# Altium schematic sheet Chaos.SchDoc: Chaos
size Tabloid; Author: Taiping Li; Organization: Midnight Sun Solar Rayce Car Team; Address1: University of Waterloo; Address2: 200 University Ave W; Address3: Waterloo, ON, Canada; Address4: N2L 3E9; Revision: 1.0; SheetNumber: 3; SheetTotal: 3; Website: www.uwmidsun.com
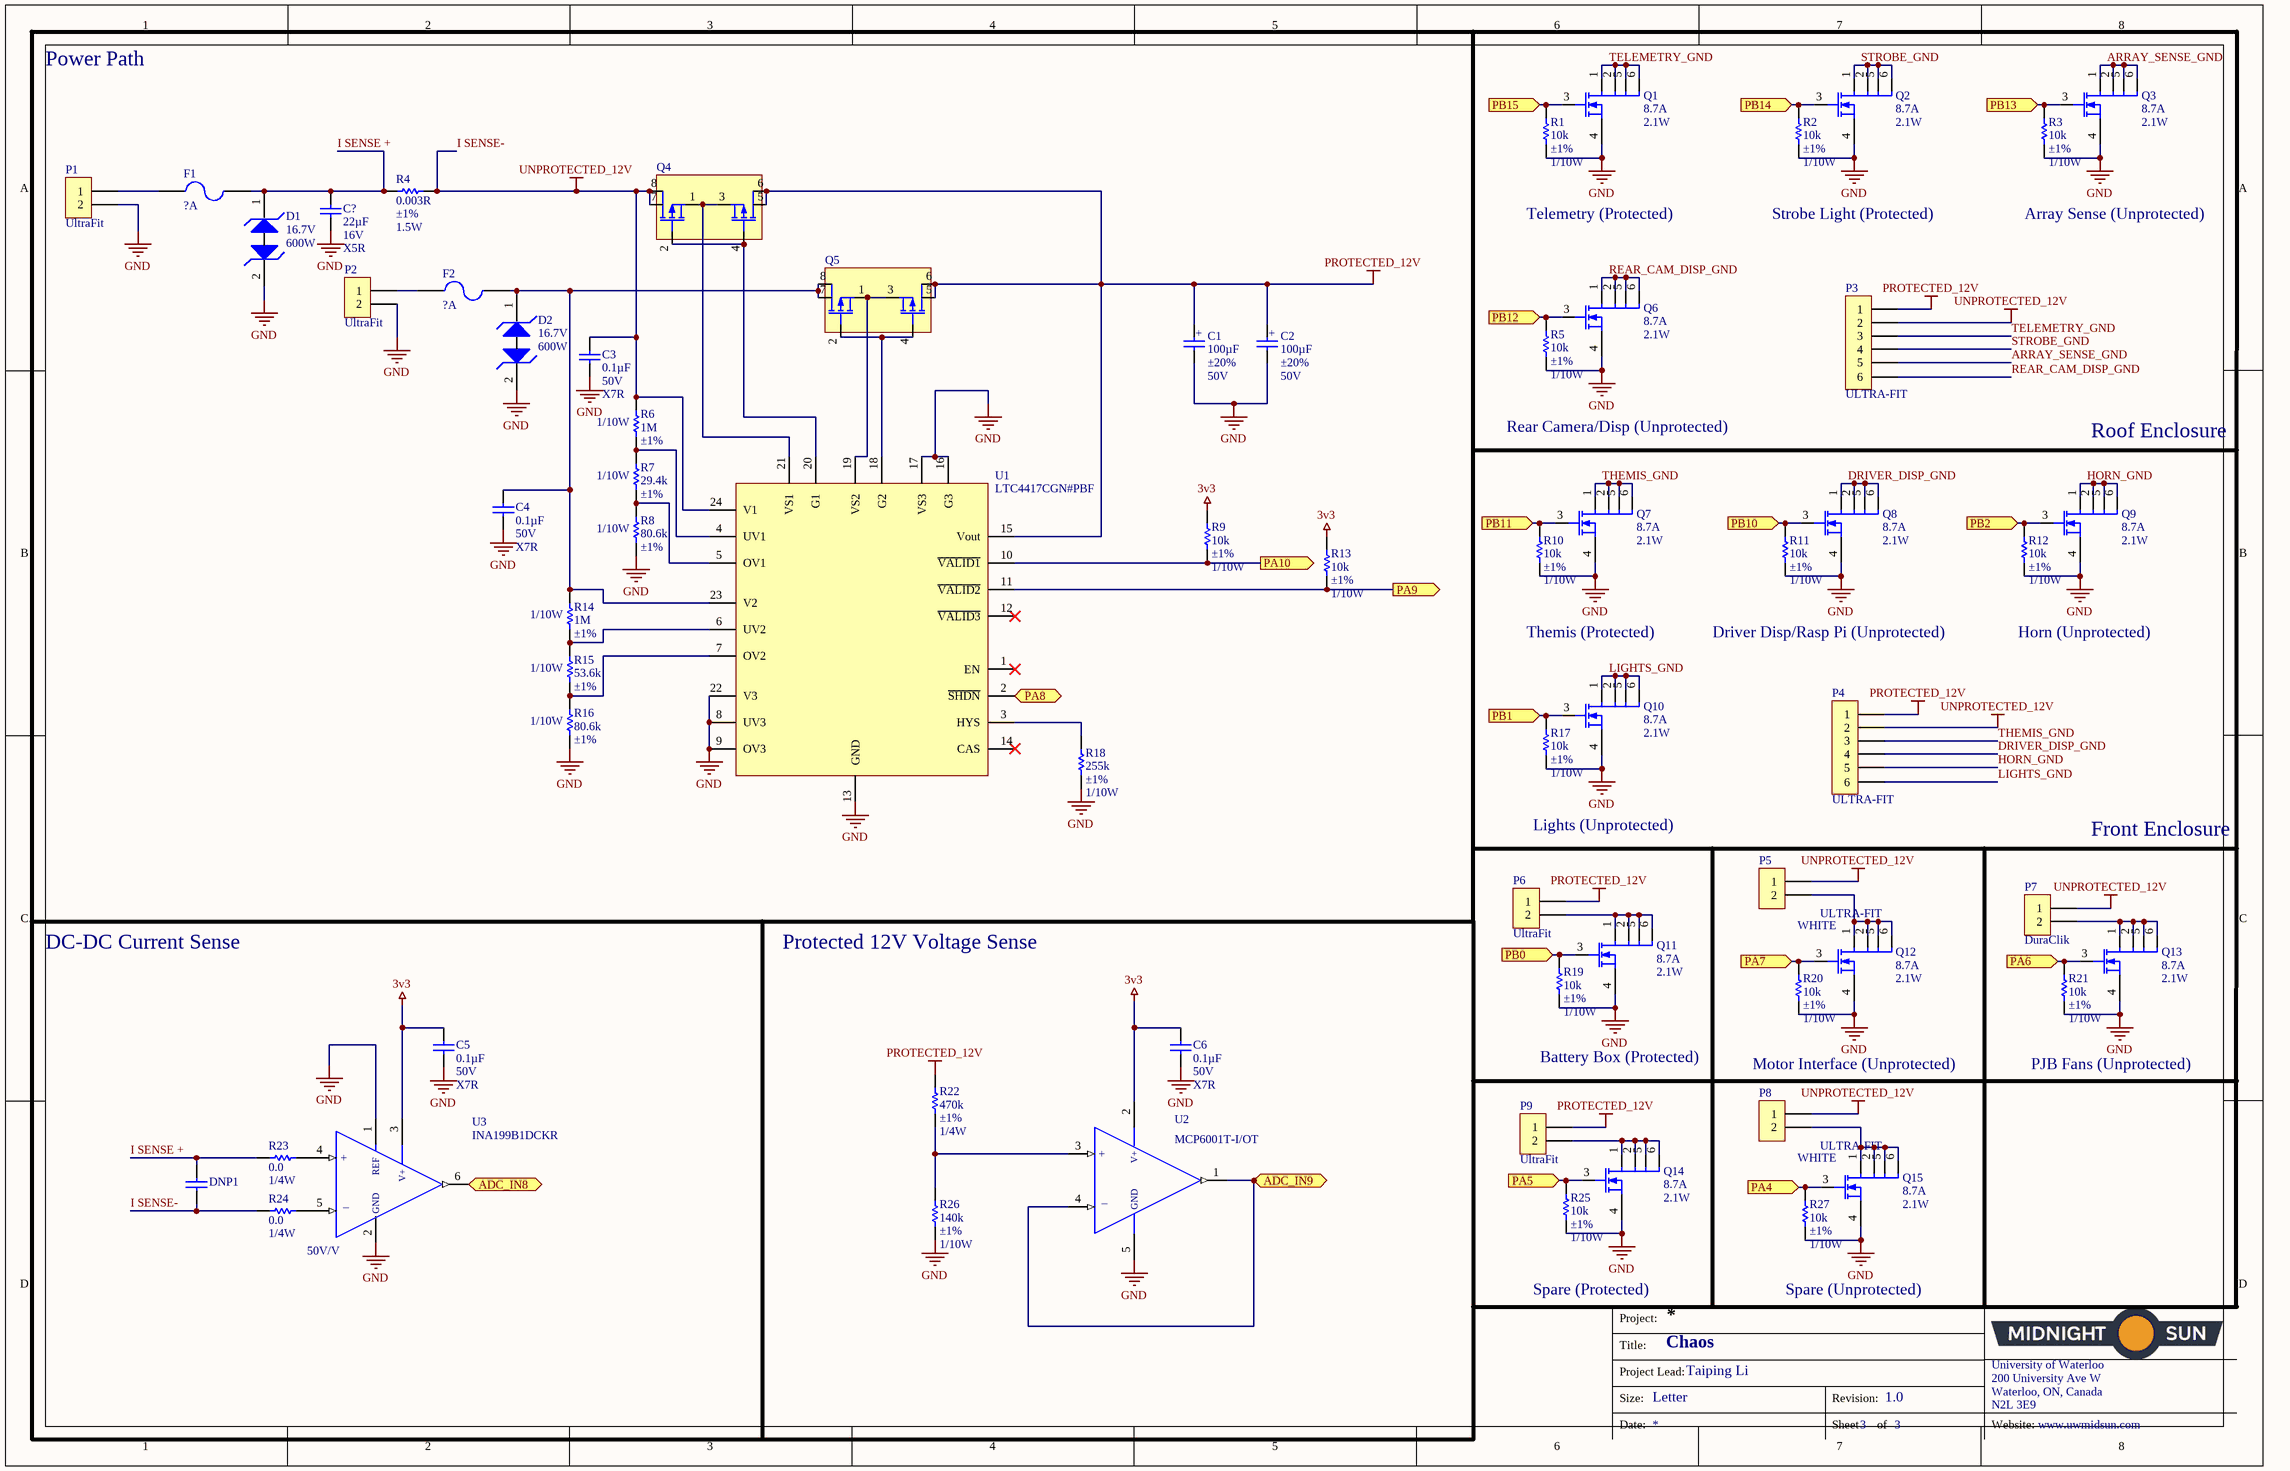
[diagram p0: Chaos.SchDoc]

## Parts
C1  Tolerance: ±20%  Capacitance: 100µF  Voltage Rating: 50V  (hidden comment: CAP ALUM 100UF 20% 50V RADIAL)
C2  Tolerance: ±20%  Capacitance: 100µF  Voltage Rating: 50V  (hidden comment: CAP ALUM 100UF 20% 50V RADIAL)
C3  Capacitance: 0.1µF  Voltage: 50V  Temperature Coefficient: X7R  [CAP, 0603]  (hidden comment: CAP CER 0.1UF 50V 10% X7R 0603)
C4  Capacitance: 0.1µF  Voltage: 50V  Temperature Coefficient: X7R  [CAP, 0603]  (hidden comment: CAP CER 0.1UF 50V 10% X7R 0603)
C5  Capacitance: 0.1µF  Voltage: 50V  Temperature Coefficient: X7R  [CAP, 0603]  (hidden comment: CAP CER 0.1UF 50V 10% X7R 0603)
C6  Capacitance: 0.1µF  Voltage: 50V  Temperature Coefficient: X7R  [CAP, 0603]  (hidden comment: CAP CER 0.1UF 50V 10% X7R 0603)
C?  Capacitance: 22µF  Voltage: 16V  Temperature Coefficient: X5R  [CAP, 1210]  (hidden comment: CAP CER 22UF 16V ±20% X5R 1210)
D1  Voltage - Breakdown (Min): 16.7V  Power - Peak Pulse: 600W  [DO-214AA Diode]  (hidden comment: DIODE TVS 15VWM 24.4VC DO-214AA (SMB))
D2  Voltage - Breakdown (Min): 16.7V  Power - Peak Pulse: 600W  [DO-214AA Diode]  (hidden comment: DIODE TVS 15VWM 24.4VC DO-214AA (SMB))
DNP1  CAP CER 0.1UF 50V 10% X7R 0603  [CAP, 0603]  (value not drawn)
F1  ?A
F2  ?A
P1  Series: UltraFit  [CONN, 2POS ULTRA-FIT]  (hidden comment: CONN 2POS ULTRA-FIT 0.138")
P2  Series: UltraFit  [CONN, 2POS ULTRA-FIT]  (hidden comment: CONN 2POS ULTRA-FIT 0.138")
P3  CONN 6POS ULTRA-FIT 0.138"  (value not drawn)
P4  CONN 6POS ULTRA-FIT 0.138"  (value not drawn)
P5  CONN 2POS ULTRA-FIT NATURAL COLOR 0.138"  [CONN, 2POS ULTRA-FIT]  (value not drawn)
P6  Series: UltraFit  [CONN, 2POS ULTRA-FIT]  (hidden comment: CONN 2POS ULTRA-FIT 0.138")
P7  Series: DuraClik  [CONN, 2POS Dura-Click]  (hidden comment: CONN 2POS DURA-CLIK 0.079")
P8  CONN 2POS ULTRA-FIT NATURAL COLOR 0.138"  [CONN, 2POS ULTRA-FIT]  (value not drawn)
P9  Series: UltraFit  [CONN, 2POS ULTRA-FIT]  (hidden comment: CONN 2POS ULTRA-FIT 0.138")
Q1  Current - Continuous Drain (Id) @ 25°C: 8.7A  Power Dissipation (Max): 2.1W  (hidden comment: MOSFET N-CH 30V 8.7A 2.1W 6-PQFN (2x2))
Q2  Current - Continuous Drain (Id) @ 25°C: 8.7A  Power Dissipation (Max): 2.1W  (hidden comment: MOSFET N-CH 30V 8.7A 2.1W 6-PQFN (2x2))
Q3  Current - Continuous Drain (Id) @ 25°C: 8.7A  Power Dissipation (Max): 2.1W  (hidden comment: MOSFET N-CH 30V 8.7A 2.1W 6-PQFN (2x2))
Q4  MOSFET DUAL P-CH 40V 8A 3.2W 8-SOIC  [SOIC8]  (value not drawn)
Q5  MOSFET DUAL P-CH 40V 8A 3.2W 8-SOIC  [SOIC8]  (value not drawn)
Q6  Current - Continuous Drain (Id) @ 25°C: 8.7A  Power Dissipation (Max): 2.1W  (hidden comment: MOSFET N-CH 30V 8.7A 2.1W 6-PQFN (2x2))
Q7  Current - Continuous Drain (Id) @ 25°C: 8.7A  Power Dissipation (Max): 2.1W  (hidden comment: MOSFET N-CH 30V 8.7A 2.1W 6-PQFN (2x2))
Q8  Current - Continuous Drain (Id) @ 25°C: 8.7A  Power Dissipation (Max): 2.1W  (hidden comment: MOSFET N-CH 30V 8.7A 2.1W 6-PQFN (2x2))
Q9  Current - Continuous Drain (Id) @ 25°C: 8.7A  Power Dissipation (Max): 2.1W  (hidden comment: MOSFET N-CH 30V 8.7A 2.1W 6-PQFN (2x2))
Q10  Current - Continuous Drain (Id) @ 25°C: 8.7A  Power Dissipation (Max): 2.1W  (hidden comment: MOSFET N-CH 30V 8.7A 2.1W 6-PQFN (2x2))
Q11  Current - Continuous Drain (Id) @ 25°C: 8.7A  Power Dissipation (Max): 2.1W  (hidden comment: MOSFET N-CH 30V 8.7A 2.1W 6-PQFN (2x2))
Q12  Current - Continuous Drain (Id) @ 25°C: 8.7A  Power Dissipation (Max): 2.1W  (hidden comment: MOSFET N-CH 30V 8.7A 2.1W 6-PQFN (2x2))
Q13  Current - Continuous Drain (Id) @ 25°C: 8.7A  Power Dissipation (Max): 2.1W  (hidden comment: MOSFET N-CH 30V 8.7A 2.1W 6-PQFN (2x2))
Q14  Current - Continuous Drain (Id) @ 25°C: 8.7A  Power Dissipation (Max): 2.1W  (hidden comment: MOSFET N-CH 30V 8.7A 2.1W 6-PQFN (2x2))
Q15  Current - Continuous Drain (Id) @ 25°C: 8.7A  Power Dissipation (Max): 2.1W  (hidden comment: MOSFET N-CH 30V 8.7A 2.1W 6-PQFN (2x2))
R1  Resistance: 10k  Tolerance: ±1%  Power: 1/10W  [RES, 0603]  (hidden comment: RES 10K OHM 1% 1/10W 0603)
R2  Resistance: 10k  Tolerance: ±1%  Power: 1/10W  [RES, 0603]  (hidden comment: RES 10K OHM 1% 1/10W 0603)
R3  Resistance: 10k  Tolerance: ±1%  Power: 1/10W  [RES, 0603]  (hidden comment: RES 10K OHM 1% 1/10W 0603)
R4  Resistance (Ohms): 0.003R  Tolerance: ±1%  Power (Watts): 1.5W  (hidden comment: RES 0.003 OHM 1% 1.5W 2010)
R5  Resistance: 10k  Tolerance: ±1%  Power: 1/10W  [RES, 0603]  (hidden comment: RES 10K OHM 1% 1/10W 0603)
R6  Resistance (Ohms): 1M  Tolerance: ±1%  Power (Watts): 1/10W  [RES, 0603]  (hidden comment: RES 1M OHM 1% 1/10W 0603)
R7  Resistance (Ohms): 29.4k  Tolerance: ±1%  Power (Watts): 1/10W  [RES, 0603]  (hidden comment: RES 29.4K OHM 1% 1/10W 0603)
R8  Resistance (Ohms): 80.6k  Tolerance: ±1%  Power (Watts): 1/10W  [RES, 0603]  (hidden comment: RES 80.6K OHM 1% 1/10W 0603)
R9  Resistance: 10k  Tolerance: ±1%  Power: 1/10W  [RES, 0603]  (hidden comment: RES 10K OHM 1% 1/10W 0603)
R10  Resistance: 10k  Tolerance: ±1%  Power: 1/10W  [RES, 0603]  (hidden comment: RES 10K OHM 1% 1/10W 0603)
R11  Resistance: 10k  Tolerance: ±1%  Power: 1/10W  [RES, 0603]  (hidden comment: RES 10K OHM 1% 1/10W 0603)
R12  Resistance: 10k  Tolerance: ±1%  Power: 1/10W  [RES, 0603]  (hidden comment: RES 10K OHM 1% 1/10W 0603)
R13  Resistance: 10k  Tolerance: ±1%  Power: 1/10W  [RES, 0603]  (hidden comment: RES 10K OHM 1% 1/10W 0603)
R14  Resistance (Ohms): 1M  Tolerance: ±1%  Power (Watts): 1/10W  [RES, 0603]  (hidden comment: RES 1M OHM 1% 1/10W 0603)
R15  Resistance (Ohms): 53.6k  Tolerance: ±1%  Power (Watts): 1/10W  (hidden comment: RES 53.6K OHM 1% 1/10W 0603)
R16  Resistance (Ohms): 80.6k  Tolerance: ±1%  Power (Watts): 1/10W  [RES, 0603]  (hidden comment: RES 80.6K OHM 1% 1/10W 0603)
R17  Resistance: 10k  Tolerance: ±1%  Power: 1/10W  [RES, 0603]  (hidden comment: RES 10K OHM 1% 1/10W 0603)
R18  Resistance (Ohms): 255k  Tolerance: ±1%  Power (Watts): 1/10W  [RES, 0603]  (hidden comment: RES 255K OHM 1% 1/10W 0603)
R19  Resistance: 10k  Tolerance: ±1%  Power: 1/10W  [RES, 0603]  (hidden comment: RES 10K OHM 1% 1/10W 0603)
R20  Resistance: 10k  Tolerance: ±1%  Power: 1/10W  [RES, 0603]  (hidden comment: RES 10K OHM 1% 1/10W 0603)
R21  Resistance: 10k  Tolerance: ±1%  Power: 1/10W  [RES, 0603]  (hidden comment: RES 10K OHM 1% 1/10W 0603)
R22  Resistance: 470k  Tolerance: ±1%  Power: 1/4W  [RES, 0603]  (hidden comment: RES 470K OHM 1% 1/4W 0603)
R23  Resistance: 0.0  Power (Watts): 1/4W  [RES, 0603]  (hidden comment: RES 0.0 OHM 1/4W 0603)
R24  Resistance: 0.0  Power (Watts): 1/4W  [RES, 0603]  (hidden comment: RES 0.0 OHM 1/4W 0603)
R25  Resistance: 10k  Tolerance: ±1%  Power: 1/10W  [RES, 0603]  (hidden comment: RES 10K OHM 1% 1/10W 0603)
R26  Resistance (Ohms): 140k  Tolerance: ±1%  Power (Watts): 1/10W  [RES, 0603]  (hidden comment: RES 140K OHM 1% 1/10W 0603)
R27  Resistance: 10k  Tolerance: ±1%  Power: 1/10W  [RES, 0603]  (hidden comment: RES 10K OHM 1% 1/10W 0603)
U1  Manufacturer Part Number 1: LTC4417CGN#PBF  [SSOP-24_GN]  (hidden comment: IC OR CONTROLLER SOURCE SELECT 24SSOP)
U2  Manufacturer Part Number 1: MCP6001T-I/OT  (hidden comment: IC OPAMP GEN PURPOSE SOT23-5)
U3  Manufacturer Part Number 1: INA199B1DCKR  Gain: 50V/V  (hidden comment: IC CURRENT AMPLIFIER SC70-6)

## Ports
ADC_IN8 (out), ADC_IN9 (out), PA4 (in), PA5 (in), PA6 (in), PA7 (in), PA8 (in), PA9 (out), PA10 (out), PB0 (in), PB1 (in), PB2 (in), PB10 (in), PB11 (in), PB12 (in), PB13 (in), PB14 (in), PB15 (in)

## Nets
3v3: C5.1 C6.1 R9.1 R13.1 U2.2(VDD) U3.3(V+)
GND: C1.2 C2.2 C3.2 C4.2 C5.2 C6.2 C?.2 D1.2(Cathode2) D2.2(Cathode2) P1.2 P2.2 Q1.4(S) Q2.4(S) Q3.4(S) Q6.4(S) Q7.4(S) Q8.4(S) Q9.4(S) Q10.4(S) Q11.4(S) Q12.4(S) Q13.4(S) Q14.4(S) Q15.4(S) R1.2 R2.2 R3.2 R5.2 R8.2 R10.2 R11.2 R12.2 R16.2 R17.2 R18.2 R19.2 R20.2 R21.2 R25.2 R26.2 R27.2 U1.8(UV3) U1.9(OV3) U1.13(GND) U1.16(G3) U1.17(VS3) U1.22(V3) U2.5(VSS) U3.1(REF) U3.2(GND)
I SENSE-: C3.1 DNP1.2 P3.2 P4.2 P5.1 P7.1 P8.1 Q4.7(D1) Q4.8(D1) R4.2 R6.1 R24.1 U1.24(V1)  [also labelled UNPROTECTED_12V]
PROTECTED_12V: C1.1 C2.1 P3.1 P4.1 P6.1 P9.1 Q4.5(D2) Q4.6(D2) Q5.5(D2) Q5.6(D2) R22.1 U1.15(Vout)
ADC_IN8: U3.6(OUTPUT) ; port ADC_IN8
ADC_IN9: U2.1(OUTPUT) U2.4(-IN) ; port ADC_IN9
ARRAY_SENSE_GND: P3.5 Q3.1(D) Q3.2(D) Q3.5(D) Q3.6(D)
DRIVER_DISP_GND: P4.4 Q8.1(D) Q8.2(D) Q8.5(D) Q8.6(D)
HORN_GND: P4.5 Q9.1(D) Q9.2(D) Q9.5(D) Q9.6(D)
I SENSE +: C?.1 D1.1(Cathode1) DNP1.1 F1.2 R4.1 R23.1
LIGHTS_GND: P4.6 Q10.1(D) Q10.2(D) Q10.5(D) Q10.6(D)
PA4: Q15.3(G) R27.1 ; port PA4
PA5: Q14.3(G) R25.1 ; port PA5
PA6: Q13.3(G) R21.1 ; port PA6
PA7: Q12.3(G) R20.1 ; port PA7
PA8: U1.2(~{SHDN}) ; port PA8
PA9: R13.2 U1.11(~{VALID2}) ; port PA9
PA10: R9.2 U1.10(~{VALID1}) ; port PA10
PB0: Q11.3(G) R19.1 ; port PB0
PB1: Q10.3(G) R17.1 ; port PB1
PB2: Q9.3(G) R12.1 ; port PB2
PB10: Q8.3(G) R11.1 ; port PB10
PB11: Q7.3(G) R10.1 ; port PB11
PB12: Q6.3(G) R5.1 ; port PB12
PB13: Q3.3(G) R3.1 ; port PB13
PB14: Q2.3(G) R2.1 ; port PB14
PB15: Q1.3(G) R1.1 ; port PB15
REAR_CAM_DISP_GND: P3.6 Q6.1(D) Q6.2(D) Q6.5(D) Q6.6(D)
STROBE_GND: P3.4 Q2.1(D) Q2.2(D) Q2.5(D) Q2.6(D)
TELEMETRY_GND: P3.3 Q1.1(D) Q1.2(D) Q1.5(D) Q1.6(D)
THEMIS_GND: P4.3 Q7.1(D) Q7.2(D) Q7.5(D) Q7.6(D)
NetC4_1: C4.1 D2.1(Cathode1) F2.2 Q5.7(D1) Q5.8(D1) R14.1 U1.23(V2)
NetF1_1: F1.1 P1.1
NetF2_1: F2.1 P2.1
NetP5_2: P5.2 Q12.1(D) Q12.2(D) Q12.5(D) Q12.6(D)
NetP6_2: P6.2 Q11.1(D) Q11.2(D) Q11.5(D) Q11.6(D)
NetP7_2: P7.2 Q13.1(D) Q13.2(D) Q13.5(D) Q13.6(D)
NetP8_2: P8.2 Q15.1(D) Q15.2(D) Q15.5(D) Q15.6(D)
NetP9_2: P9.2 Q14.1(D) Q14.2(D) Q14.5(D) Q14.6(D)
NetQ4_1: Q4.1(S1) Q4.3(S2) U1.21(VS1)
NetQ4_2: Q4.2(G1) Q4.4(G2) U1.20(G1)
NetQ5_1: Q5.1(S1) Q5.3(S2) U1.19(VS2)
NetQ5_2: Q5.2(G1) Q5.4(G2) U1.18(G2)
NetR6_2: R6.2 R7.1 U1.4(UV1)
NetR7_2: R7.2 R8.1 U1.5(OV1)
NetR14_2: R14.2 R15.1 U1.6(UV2)
NetR15_2: R15.2 R16.1 U1.7(OV2)
NetR18_1: R18.1 U1.3(HYS)
NetR22_2: R22.2 R26.1 U2.3(+IN)
NetR23_2: R23.2 U3.4(+IN)
NetR24_2: R24.2 U3.5(-IN)

Not connected (* = marked no-connect by the designer): U1 1(EN)* 12(~{VALID3})* 14(CAS)*

## Notes on the sheet
- Power Path
- Telemetry (Protected)
- Strobe Light (Protected)
- Array Sense (Unprotected)
- Rear Camera/Disp (Unprotected)
- Roof Enclosure
- Themis (Protected)
- Driver Disp/Rasp Pi (Unprotected)
- Horn (Unprotected)
- Lights (Unprotected)
- Front Enclosure
- DC-DC Current Sense
- Protected 12V Voltage Sense
- Battery Box (Protected)
- Motor Interface (Unprotected)
- PJB Fans (Unprotected)
- Spare (Protected)
- Spare (Unprotected)
- Project:
- Title:
- Size:
- Project Lead:
- Letter
- Revision:
- University of Waterloo
- 200 University Ave W
- Waterloo, ON, Canada
- N2L 3E9
- Date:
- Sheet
- of
- Website:
- (in symbol CAP ALUM 100UF 20% 50V RADIAL) +
- (in symbol CONN 2POS ULTRA-FIT NATURAL COLOR 0.138") ULTRA-FIT; WHITE
- (in symbol CONN 6POS ULTRA-FIT 0.138") ULTRA-FIT
- (in symbol IC CURRENT AMPLIFIER SC70-6) +; _
- (in symbol IC OPAMP GEN PURPOSE SOT23-5) V+; +; GND; _

## Library data of the parts
C1 C2 = CAP ALUM 100UF 20% 50V RADIAL: 100µF 50V Aluminum Capacitors Radial, Can 74 mOhm @ 100kHz 3000 Hrs @ 105°C; Manufacturer 1: KEMET; Manufacturer Part Number 1: ESY107M050AG3AA; Polarization: Polar; Ripple Current - Low Frequency: 511mA @ 120Hz; Ripple Current - High Frequency: 730mA @ 100kHz; Impedance: 74 mOhm; Supplier 1: Digi-Key; Supplier Part Number 1: 399-6119-ND; RoHS: RoHS Compliant; Description 1: CAP ALUM 100UF 20% 50V RADIAL; Category: Capacitors; Stock 1: 7068; Pricing 1: 1=0.5, 10=0.345, 100=0.2074, 500=0.15558, 1000=0.13138, 2500=0.12446, 5000=0.11755 (CAD); Packaging: Bulk; Part Status: Active; ESR (Equivalent Series Resistance): 74 mOhm @ 100kHz; Lifetime @ Temp.: 3000 Hrs @ 105°C; Operating Temperature: -40°C ~ 105°C; Applications: General Purpose; Lead Spacing: 0.138" (3.50mm); Size / Dimension: 0.315" Dia (8.00mm); Height - Seated (Max): 0.492" (12.50mm); Surface Mount Land Size: -; Mounting Type: Through Hole; Package / Case: Radial, Can; ComponentLink1URL: http://capacitoredge.kemet.com/capedge2/DataSheet?pn=ESY107M050AG3AA; ComponentLink1Description: http://capacitoredge.kemet.com/capedge2/DataSheet?pn=ESY107M050AG3AA
C3-C6 DNP1 = CAP CER 0.1UF 50V 10% X7R 0603: 0.10µF ±10% 50V Ceramic Capacitor X7R 0603 (1608 Metric); Manufacturer 1: AVX Corporation; Manufacturer Part Number 1: 06035C104KAT2A; Supplier 1: Digi-Key; Supplier Part Number 1: 478-5052-1-ND; Packaging: Cut Tape (CT); Part Status: Active; Operating Temperature: -55°C ~ 125°C; Ratings: -; Mounting Type: Surface Mount, MLCC; Package / Case: 0603 (1608 Metric); Size / Dimension: 0.063" L x 0.032" W (1.60mm x 0.81mm); Height - Seated (Max): -; Thickness (Max): 0.035" (0.90mm); Lead Spacing: -; Lead Style: -; ComponentLink1URL: http://datasheets.avx.com/X7RDielectric.pdf; ComponentLink1Description: http://datasheets.avx.com/X7RDielectric.pdf; Tolerance: ±10%
C? = CAP CER 22UF 16V ±20% X5R 1210: 22µF ±20% 16V Ceramic Capacitor X5R 1210 (3225 Metric); Manufacturer 1: Murata Electronics North America; Manufacturer Part Number 1: GRM32ER61C226ME20L; Supplier 1: Digi-Key; Supplier Part Number 1: 490-1881-1-ND; Packaging: Cut Tape (CT); Part Status: Active; Operating Temperature: -55°C ~ 85°C; Ratings: -; Mounting Type: Surface Mount, MLCC; Package / Case: 1210 (3225 Metric); Size / Dimension: 0.126" L x 0.098" W (3.20mm x 2.50mm); Height - Seated (Max): -; Thickness (Max): 0.106" (2.70mm); Lead Spacing: -; Lead Style: -; ComponentLink1URL: http://www.murata.com/~/media/webrenewal/support/library/catalog/products/capacitor/mlcc/c02e.ashx; ComponentLink1Description: http://www.murata.com/~/media/webrenewal/support/library/catalog/products/capacitor/mlcc/c02e.ashx; Tolerance: ±20%
D1 D2 = DIODE TVS 15VWM 24.4VC DO-214AA (SMB): TVS DIODE 15VWM 24.4VC SMB; Manufacturer 1: Fairchild/ON Semiconductor; Manufacturer Part Number 1: SMBJ15CA; Type: Zener; Voltage - Reverse Standoff (Typ): 15V; Voltage - Clamping (Max) @ Ipp: 24.4V; Current - Peak Pulse (10/1000µs): 24.6A; Power Line Protection: No; Supplier 1: Digi-Key; Supplier Part Number 1: SMBJ15CAFSCT-ND; RoHS: RoHS Compliant; Description 1: TVS DIODE 15VWM 24.4VC SMB; Category: Circuit Protection; Stock 1: 24965; Pricing 1: 1=0.54, 10=0.444, 100=0.3027, 500=0.22704, 1000=0.17028 (CAD); Packaging: Cut Tape (CT); Part Status: Active; Applications: General Purpose; Capacitance @ Frequency: -; Operating Temperature: -55°C ~ 150°C (TJ); Mounting Type: Surface Mount; Package / Case: DO-214AA, SMB; Supplier Device Package: DO-214AA (SMB); ComponentLink1URL: https://www.fairchildsemi.com/datasheets/SM/SMBJ10CA.pdf; ComponentLink1Description: https://www.fairchildsemi.com/datasheets/SM/SMBJ10CA.pdf
F1 F2 = FUSE ATO FUSE HOLDER: Manufacturer 1: Keystone Electronics; Manufacturer Part Number 1: 3557; Description 1: FUSE CLIP BLADE 500V 30A PCB; Fuseholder Type: Clip; Fuse Type: Blade; For Use With/Related Products: ATC, ATO, MINI ATC, MINI ATO; Number of Circuits: 1; Voltage: 500V; Current Rating: 30A; Supplier 1: Digi-Key; Supplier Part Number 1: 36-3557-ND; RoHS: RoHS Compliant; Category: Circuit Protection; Stock 1: 117268; Pricing 1: 1=0.36, 10=0.333, 50=0.263, 100=0.2312, 250=0.20456, 500=0.19562, 1000=0.16005, 2500=0.14672, 5000=0.14227 (CAD); Part Status: Active; Fuse Size: -; Mounting Type: PCB; Orientation: Vertical; Termination Style: PC Pin; Contact Material: Brass; Contact Finish: Tin Nickel; ComponentLink1URL: http://www.keyelco.com/product-pdf.cfm?p=1131; ComponentLink1Description: http://www.keyelco.com/product-pdf.cfm?p=1131
P1 P2 P6 P9 = CONN 2POS ULTRA-FIT 0.138": 2 Positions Header, Shrouded Connector 0.138" (3.50mm) Through Hole Gold; Manufacturer 1: Molex, LLC; Manufacturer Part Number 1: 1722861302; Style: Board to Board or Cable; Shrouding: Shrouded - 4 Wall; Number of Positions: 2; Number of Positions Loaded: All; Contact Length - Post: 0.126" (3.20mm); Material Flammability Rating: UL94 V-0; Mated Stacking Heights: 26.99mm; Voltage: 400V; Supplier 1: Digi-Key; Supplier Part Number 1: WM11673-ND; Packaging: Tray; Part Status: Active; Connector Type: Header; Contact Type: Male Pin; Pitch - Mating: 0.138" (3.50mm); Number of Rows: 1; Row Spacing - Mating: -; Mounting Type: Through Hole; Termination: Kinked Pin, Solder; Fastening Type: Latch Holder; Contact Length - Mating: -; Overall Contact Length: -; Insulation Height: 0.465" (11.80mm); Contact Shape: Square; Contact Finish - Mating: Gold; Contact Finish Thickness - Mating: 30µin (0.76µm); Contact Finish - Post: Tin; Contact Material: Copper Alloy; Insulation Material: Liquid Crystal Polymer (LCP); Operating Temperature: -40°C ~ 120°C; Ingress Protection: -; Insulation Color: Black; Current Rating: -; Contact Finish Thickness - Post: 60µin (1.52µm); ComponentLink1URL: http://www.molex.com/pdm_docs/sd/1722861302_sd.pdf; ComponentLink1Description: http://www.molex.com/pdm_docs/sd/1722861302_sd.pdf
P3 P4 = CONN 6POS ULTRA-FIT 0.138": Manufacturer: Molex, LLC; Manufacturer Part Number: 1722991106; Connector Type: Header; Pitch - Mating: 0.138" (3.50mm); Style: Board to Cable/Wire; Shrouding: Shrouded - 4 Wall; Number of Positions: 6; Number of Positions Loaded: All; Row Spacing - Mating: 0.181" (4.60mm); Contact Length - Post: 0.126" (3.20mm); Material Flammability Rating: UL94 V-0; Voltage Rating: 400V; Mated Stacking Heights: 26.99mm; Supplier 1: Digi-Key; RoHS: RoHS Compliant; Category: Connectors, Interconnects; Stock 1: 291; Pricing 1: 1=1.66, 10=1.46, 50=1.317, 100=1.2599, 250=1.14536, 500=1.03082, 1000=0.91629, 2500=0.83039, 5000=0.80175 (CAD); Packaging: Tray; Part Status: Active; Contact Type: Male Pin; Number of Rows: 2; Mounting Type: Through Hole; Termination: Solder; Fastening Type: Latch Holder; Contact Length - Mating: -; Overall Contact Length: -; Insulation Height: 0.465" (11.80mm); Contact Shape: Square; Contact Finish - Mating: Tin; Contact Finish Thickness - Mating: 60µin (1.52µm); Contact Finish - Post: Tin; Contact Material: Copper Alloy; Insulation Material: Liquid Crystal Polymer (LCP); Features: Board Guide, Solder Retention; Operating Temperature: -40°C ~ 105°C; Ingress Protection: -; Insulation Color: Black; Current Rating: -; Contact Finish Thickness - Post: 60µin (1.52µm); Applications: Automotive, General Purpose, Industrial, Lighting, Medical, Military, Telecommunications; ComponentLink1URL: http://www.molex.com/pdm_docs/sd/1722991106_sd.pdf; ComponentLink1Description: http://www.molex.com/pdm_docs/sd/1722991106_sd.pdf
P5 P8 = CONN 2POS ULTRA-FIT NATURAL COLOR 0.138": 2 Positions Header, Shrouded Connector 0.138" (3.50mm) Through Hole; Manufacturer: Molex, LLC; Manufacturer Part Number: 1722872102; Style: Board to Cable/Wire; Shrouding: Shrouded - 4 Wall; Number of Positions: 2; Number of Positions Loaded: All; Contact Length - Post: 0.126" (3.20mm); Material Flammability Rating: UL94 V-0; Voltage Rating: 400V; Mated Stacking Heights: 26.99mm; Supplier 1: Digi-Key; RoHS: RoHS Compliant; Category: Connectors, Interconnects; Stock 1: 291; Pricing 1: 1=1.21, 10=1.06, 25=0.9976, 50=0.956, 100=0.9146, 250=0.8314, 500=0.74824, 1000=0.66511, 2500=0.60276 (CAD); Packaging: Tray; Part Status: Active; Connector Type: Header; Contact Type: Male Pin; Pitch - Mating: 0.138" (3.50mm); Number of Rows: 1; Row Spacing - Mating: -; Mounting Type: Through Hole; Termination: Solder; Fastening Type: Latch Holder; Contact Length - Mating: -; Overall Contact Length: -; Insulation Height: 0.465" (11.80mm); Contact Shape: Square; Contact Finish - Mating: Tin; Contact Finish Thickness - Mating: 60µin (1.52µm); Contact Finish - Post: Tin; Contact Material: Copper Alloy; Insulation Material: Liquid Crystal Polymer (LCP); Features: Board Guide, Solder Retention; Operating Temperature: -40°C ~ 105°C; Ingress Protection: -; Insulation Color: Natural; Current Rating: -; Contact Finish Thickness - Post: 60µin (1.52µm); Applications: Automotive, General Purpose, Industrial, Lighting, Medical, Military, Telecommunications; ComponentLink1URL: http://www.molex.com/pdm_docs/sd/1722872102_sd.pdf; ComponentLink1Description: http://www.molex.com/pdm_docs/sd/1722872102_sd.pdf
P7 = CONN 2POS DURA-CLIK 0.079": 2 Positions Header, Shrouded Connector 0.079" (2.00mm) Surface Mount, Right Angle Tin; Manufacturer 1: Molex, LLC; Manufacturer Part Number 1: 5023520200; Style: Board to Cable/Wire; Shrouding: Shrouded - 4 Wall; Number of Positions: 2; Number of Positions Loaded: All; Contact Length - Mating: 0.135" (3.45mm); Material Flammability Rating: UL94 V-0; Mated Stacking Heights: 11mm; Supplier 1: Digi-Key; Supplier Part Number 1: WM7169CT-ND; Packaging: Cut Tape (CT); Part Status: Active; Connector Type: Header; Contact Type: Male Pin; Number of Rows: 1; Row Spacing - Mating: -; Mounting Type: Surface Mount, Right Angle; Termination: Solder; Fastening Type: Latch Lock; Contact Length - Post: -; Overall Contact Length: -; Insulation Height: 0.252" (6.40mm); Contact Shape: Square; Contact Finish - Mating: Tin; Contact Finish Thickness - Mating: -; Contact Finish - Post: Tin; Contact Material: Copper Alloy; Insulation Material: Polyamide (PA), Nylon; Operating Temperature: -; Ingress Protection: -; Insulation Color: Natural; Current Rating: -; Contact Finish Thickness - Post: -; ComponentLink1URL: http://www.molex.com/pdm_docs/sd/5023520200_sd.pdf; ComponentLink1Description: http://www.molex.com/pdm_docs/sd/5023520200_sd.pdf; Voltage: -; Pitch - Mating: 0.079" (2.00mm)
Q1-Q3 Q6-Q15 = MOSFET N-CH 30V 8.7A 2.1W 6-PQFN (2x2): Manufacturer 1: Infineon Technologies; Manufacturer Part Number 1: IRLHS6342TRPBF; Description 1: MOSFET N-CH 30V 8.7A 2X2 PQFN; FET Type: N-Channel; Drive Voltage (Max Rds On,  Min Rds On): 2.5V, 4.5V; Vgs(th) (Max) @ Id: 1.1V @ 10µA; Gate Charge (Qg) (Max) @ Vgs: 11nC @ 4.5V; Input Capacitance (Ciss) (Max) @ Vds: 1019pF @ 25V; Vgs (Max): ±12V; Rds On (Max) @ Id, Vgs: 15.5 mOhm @ 8.5A, 4.5V; Supplier 1: Digi-Key; Supplier Part Number 1: IRLHS6342TRPBFCT-ND; RoHS: RoHS Compliant; Category: Discrete Semiconductor Products; Stock 1: 9984; Pricing 1: 1=0.79, 10=0.685, 100=0.5118, 500=0.4022, 1000=0.31079 (CAD); Packaging: Cut Tape (CT); Part Status: Active; Technology: MOSFET (Metal Oxide); Drain to Source Voltage (Vdss): 30V; FET Feature: -; Operating Temperature: -55°C ~ 150°C (TJ); Mounting Type: Surface Mount; Supplier Device Package: 6-PQFN (2x2); Package / Case: 6-PowerVDFN; ComponentLink1URL: http://www.infineon.com/dgdl/irlhs6342pbf.pdf?fileId=5546d462533600a401535663b52625ad; ComponentLink1Description: http://www.infineon.com/dgdl/irlhs6342pbf.pdf?fileId=5546d462533600a401535663b52625ad
Q4 Q5 = MOSFET DUAL P-CH 40V 8A 3.2W 8-SOIC: Mosfet Array 2 P-Channel (Dual) 40V 8A 3.2W Surface Mount 8-SO; Manufacturer 1: Vishay Siliconix; Manufacturer Part Number 1: SI4909DY-T1-GE3; Description 1: MOSFET 2P-CH 40V 8A 8SO; FET Feature: Logic Level Gate; Rds On (Max) @ Id, Vgs: 27 mOhm @ 8A, 10V; Vgs(th) (Max) @ Id: 2.5V @ 250µA; Gate Charge (Qg) (Max) @ Vgs: 63nC @ 10V; Input Capacitance (Ciss) (Max) @ Vds: 2000pF @ 20V; Supplier 1: Digi-Key; Supplier Part Number 1: SI4909DY-T1-GE3CT-ND; RoHS: RoHS Compliant; Category: Discrete Semiconductor Products; Stock 1: 11582; Pricing 1: 1=1.57, 10=1.407, 25=1.3352, 100=1.0969, 250=1.02536, 500=0.90614, 1000=0.71538 (CAD); Packaging: Cut Tape (CT); Part Status: Active; FET Type: 2 P-Channel (Dual); Operating Temperature: -55°C ~ 150°C (TJ); Mounting Type: Surface Mount; Package / Case: 8-SOIC (0.154", 3.90mm Width); Supplier Device Package: 8-SO; ComponentLink1URL: http://www.vishay.com/docs/67077/si4909dy.pdf; ComponentLink1Description: http://www.vishay.com/docs/67077/si4909dy.pdf
R1-R3 R5 R9-R13 R17 R19-R21 R25 R27 = RES 10K OHM 1% 1/10W 0603: RES SMD 10K OHM 1% 1/10W 0603; Manufacturer 1: Yageo; Manufacturer Part Number 1: RC0603FR-0710KL; Temperature Coefficient: ±100ppm/°C; Supplier 1: Digi-Key; Supplier Part Number 1: 311-10.0KHRCT-ND; Packaging: Cut Tape (CT); Part Status: Active; Composition: Thick Film; Operating Temperature: -55°C ~ 155°C; Package / Case: 0603 (1608 Metric); Supplier Device Package: 0603; Size / Dimension: 0.063" L x 0.031" W (1.60mm x 0.80mm); Height - Seated (Max): 0.022" (0.55mm); Failure Rate: -; ComponentLink1URL: http://www.yageo.com/documents/recent/PYu-RC_Group_51_RoHS_L_7.pdf; ComponentLink1Description: http://www.yageo.com/documents/recent/PYu-RC_Group_51_RoHS_L_7.pdf
R4 = RES 0.003 OHM 1% 1.5W 2010: 0.003 Ohm ±1% 1.5W Chip Resistor 2010 (5025 Metric) Current Sense, Moisture Resistant Metal Foil; Manufacturer 1: Stackpole Electronics Inc.; Manufacturer Part Number 1: CSNL2010FT3L00; Description 1: RES SMD 0.003 OHM 1% 1.5W 2010; Temperature Coefficient: ±50ppm/°C; Supplier 1: Digi-Key; Supplier Part Number 1: CSNL2010FT3L00CT-ND; RoHS: RoHS Compliant; Category: Resistors; Stock 1: 18532; Pricing 1: 1=1.02, 10=0.844, 25=0.7232, 50=0.6508, 100=0.5665, 250=0.5062, 500=0.4098, 1000=0.33145 (CAD); Packaging: Cut Tape (CT); Part Status: Active; Composition: Metal Foil; Features: Current Sense, Moisture Resistant; Operating Temperature: -55°C ~ 170°C; Package / Case: 2010 (5025 Metric); Supplier Device Package: 2010; Size / Dimension: 0.200" L x 0.100" W (5.08mm x 2.54mm); Height - Seated (Max): 0.041" (1.04mm); Failure Rate: -; ComponentLink1URL: https://www.seielect.com/Catalog/SEI-csnl.pdf; ComponentLink1Description: https://www.seielect.com/Catalog/SEI-csnl.pdf
R6 R14 = RES 1M OHM 1% 1/10W 0603: 1M Ohm ±1% 0.1W, 1/10W Chip Resistor 0603 (1608 Metric) Moisture Resistant Thick Film; Manufacturer 1: Yageo; Manufacturer Part Number 1: RC0603FR-071ML; Description 1: RES SMD 1M OHM 1% 1/10W 0603; Temperature Coefficient: ±100ppm/°C; Supplier 1: Digi-Key; Supplier Part Number 1: 311-1.00MHRCT-ND; RoHS: RoHS Compliant; Category: Resistors; Stock 1: 2336711; Pricing 1: 1=0.16, 10=0.022, 100=0.0089, 1000=0.00402, 2500=0.00349 (CAD); Packaging: Cut Tape (CT); Part Status: Active; Composition: Thick Film; Features: Moisture Resistant; Operating Temperature: -55°C ~ 155°C; Package / Case: 0603 (1608 Metric); Supplier Device Package: 0603; Size / Dimension: 0.063" L x 0.031" W (1.60mm x 0.80mm); Height - Seated (Max): 0.022" (0.55mm); Failure Rate: -; ComponentLink1URL: http://www.yageo.com/documents/recent/PYu-RC_Group_51_RoHS_L_7.pdf; ComponentLink1Description: http://www.yageo.com/documents/recent/PYu-RC_Group_51_RoHS_L_7.pdf
R7 = RES 29.4K OHM 1% 1/10W 0603: 29.4k Ohm ±1% 0.1W, 1/10W Chip Resistor 0603 (1608 Metric) Moisture Resistant Thick Film; Manufacturer 1: Yageo; Manufacturer Part Number 1: RC0603FR-0729K4L; Description 1: RES SMD 29.4K OHM 1% 1/10W 0603; Temperature Coefficient: ±100ppm/°C; Supplier 1: Digi-Key; Supplier Part Number 1: 311-29.4KHRCT-ND; RoHS: RoHS Compliant; Category: Resistors; Stock 1: 76118; Pricing 1: 1=0.16, 10=0.022, 100=0.0089, 1000=0.00402, 2500=0.00349 (CAD); Packaging: Cut Tape (CT); Part Status: Active; Composition: Thick Film; Features: Moisture Resistant; Operating Temperature: -55°C ~ 155°C; Package / Case: 0603 (1608 Metric); Supplier Device Package: 0603; Size / Dimension: 0.063" L x 0.031" W (1.60mm x 0.80mm); Height - Seated (Max): 0.022" (0.55mm); Failure Rate: -; ComponentLink1URL: http://www.yageo.com/documents/recent/PYu-RC_Group_51_RoHS_L_7.pdf; ComponentLink1Description: http://www.yageo.com/documents/recent/PYu-RC_Group_51_RoHS_L_7.pdf
R8 R16 = RES 80.6K OHM 1% 1/10W 0603: 80.6k Ohm ±1% 0.1W, 1/10W Chip Resistor 0603 (1608 Metric) Moisture Resistant Thick Film; Manufacturer 1: Yageo; Manufacturer Part Number 1: RC0603FR-0780K6L; Description 1: RES SMD 80.6K OHM 1% 1/10W 0603; Temperature Coefficient: ±100ppm/°C; Supplier 1: Digi-Key; Supplier Part Number 1: 311-80.6KHRCT-ND; RoHS: RoHS Compliant; Category: Resistors; Stock 1: 147261; Pricing 1: 1=0.16, 10=0.022, 100=0.0089, 1000=0.00402, 2500=0.00349 (CAD); Packaging: Cut Tape (CT); Part Status: Active; Composition: Thick Film; Features: Moisture Resistant; Operating Temperature: -55°C ~ 155°C; Package / Case: 0603 (1608 Metric); Supplier Device Package: 0603; Size / Dimension: 0.063" L x 0.031" W (1.60mm x 0.80mm); Height - Seated (Max): 0.022" (0.55mm); Failure Rate: -; ComponentLink1URL: http://www.yageo.com/documents/recent/PYu-RC_Group_51_RoHS_L_7.pdf; ComponentLink1Description: http://www.yageo.com/documents/recent/PYu-RC_Group_51_RoHS_L_7.pdf
R15 = RES 53.6K OHM 1% 1/10W 0603: 53.6k Ohm ±1% 0.1W, 1/10W Chip Resistor 0603 (1608 Metric) Moisture Resistant Thick Film; Manufacturer 1: Yageo; Manufacturer Part Number 1: RC0603FR-0753K6L; Description 1: RES SMD 53.6K OHM 1% 1/10W 0603; Temperature Coefficient: ±100ppm/°C; Supplier 1: Digi-Key; Supplier Part Number 1: 311-53.6KHRCT-ND; RoHS: RoHS Compliant; Category: Resistors; Stock 1: 89612; Pricing 1: 1=0.16, 10=0.022, 100=0.0089, 1000=0.00402, 2500=0.00349 (CAD); Packaging: Cut Tape (CT); Part Status: Active; Composition: Thick Film; Features: Moisture Resistant; Operating Temperature: -55°C ~ 155°C; Package / Case: 0603 (1608 Metric); Supplier Device Package: 0603; Size / Dimension: 0.063" L x 0.031" W (1.60mm x 0.80mm); Height - Seated (Max): 0.022" (0.55mm); Failure Rate: -; ComponentLink1URL: http://www.yageo.com/documents/recent/PYu-RC_Group_51_RoHS_L_7.pdf; ComponentLink1Description: http://www.yageo.com/documents/recent/PYu-RC_Group_51_RoHS_L_7.pdf
R18 = RES 255K OHM 1% 1/10W 0603: 255k Ohm ±1% 0.1W, 1/10W Chip Resistor 0603 (1608 Metric) Moisture Resistant Thick Film; Manufacturer 1: Yageo; Manufacturer Part Number 1: RC0603FR-07255KL; Description 1: RES SMD 255K OHM 1% 1/10W 0603; Temperature Coefficient: ±100ppm/°C; Supplier 1: Digi-Key; Supplier Part Number 1: 311-255KHRCT-ND; RoHS: RoHS Compliant; Category: Resistors; Stock 1: 106564; Pricing 1: 1=0.16, 10=0.022, 100=0.0089, 1000=0.00402, 2500=0.00349 (CAD); Packaging: Cut Tape (CT); Part Status: Active; Composition: Thick Film; Features: Moisture Resistant; Operating Temperature: -55°C ~ 155°C; Package / Case: 0603 (1608 Metric); Supplier Device Package: 0603; Size / Dimension: 0.063" L x 0.031" W (1.60mm x 0.80mm); Height - Seated (Max): 0.022" (0.55mm); Failure Rate: -; ComponentLink1URL: http://www.yageo.com/documents/recent/PYu-RC_Group_51_RoHS_L_7.pdf; ComponentLink1Description: http://www.yageo.com/documents/recent/PYu-RC_Group_51_RoHS_L_7.pdf
R22 = RES 470K OHM 1% 1/4W 0603: RES SMD 470K OHM 1% 1/4W 0603; Manufacturer 1: Panasonic Electronic Components; Manufacturer Part Number 1: ERJ-PA3F4703V; Temperature Coefficient: ±100ppm/°C; Supplier 1: Digi-Key; Supplier Part Number 1: P470KBYCT-ND; Packaging: Cut Tape (CT); Part Status: Active; Composition: Thick Film; Operating Temperature: -55°C ~ 155°C; Package / Case: 0603 (1608 Metric); Supplier Device Package: 0603; Size / Dimension: 0.063" L x 0.031" W (1.60mm x 0.80mm); Height - Seated (Max): 0.022" (0.55mm); Failure Rate: -; ComponentLink1URL: https://industrial.panasonic.com/cdbs/www-data/pdf/RDO0000/AOA0000C291.pdf; ComponentLink1Description: https://industrial.panasonic.com/cdbs/www-data/pdf/RDO0000/AOA0000C291.pdf
R23 R24 = RES 0.0 OHM 1/4W 0603: RES SMD 0.0 OHM JUMPER 1/4W 0603; Manufacturer 1: Vishay Dale; Manufacturer Part Number 1: CRCW06030000Z0EAHP; Supplier 1: Digi-Key; Supplier Part Number 1: 541-0.0SBCT-ND; Packaging: Cut Tape (CT); Part Status: Active; Composition: Thick Film; Operating Temperature: -55°C ~ 155°C; Package / Case: 0603 (1608 Metric); Supplier Device Package: 0603; Size / Dimension: 0.063" L x 0.033" W (1.60mm x 0.85mm); Height - Seated (Max): 0.022" (0.55mm); Failure Rate: -; ComponentLink1URL: http://www.vishay.com/docs/20043/crcwhpe3.pdf; ComponentLink1Description: http://www.vishay.com/docs/20043/crcwhpe3.pdf
R26 = RES 140K OHM 1% 1/10W 0603: Manufacturer 1: Yageo; Manufacturer Part Number 1: RC0603FR-07140KL; Description 1: RES SMD 140K OHM 1% 1/10W 0603; Temperature Coefficient: ±100ppm/°C; Supplier 1: Digi-Key; Supplier Part Number 1: 311-140KHRCT-ND; RoHS: RoHS Compliant; Category: Resistors; Stock 1: 55332; Pricing 1: 1=0.16, 10=0.022, 100=0.0089, 1000=0.00402, 2500=0.00349 (CAD); Packaging: Cut Tape (CT); Part Status: Active; Composition: Thick Film; Features: Moisture Resistant; Operating Temperature: -55°C ~ 155°C; Package / Case: 0603 (1608 Metric); Supplier Device Package: 0603; Size / Dimension: 0.063" L x 0.031" W (1.60mm x 0.80mm); Height - Seated (Max): 0.022" (0.55mm); Failure Rate: -; ComponentLink1URL: http://www.yageo.com/documents/recent/PYu-RC_Group_51_RoHS_L_7.pdf; ComponentLink1Description: http://www.yageo.com/documents/recent/PYu-RC_Group_51_RoHS_L_7.pdf
U1 = IC OR CONTROLLER SOURCE SELECT 24SSOP: OR Controller Source Selector Switch P-Channel 3:1 24-SSOP; Manufacturer 1: Linear Technology; Internal Switch(s): No; Current - Supply: 28µA; Voltage - Supply: 2.5 V ~ 36 V; Supplier 1: Digi-Key; Supplier Part Number 1: LTC4417CGN#PBF-ND; Packaging: Tube; Part Status: Active; Type: Source Selector Switch; FET Type: P-Channel; Ratio - Input:Output: 3:1; Current - Output (Max): -; Operating Temperature: 0°C ~ 70°C; Mounting Type: Surface Mount; Package / Case: 24-SSOP (0.154", 3.90mm Width); Supplier Device Package: 24-SSOP; ComponentLink1URL: http://www.linear.com/docs/42408; ComponentLink1Description: http://www.linear.com/docs/42408
U2 = IC OPAMP GEN PURPOSE SOT23-5: General Purpose Amplifier 1 Circuit Rail-to-Rail SOT-23-5; Manufacturer 1: Microchip Technology; Description 1: IC OPAMP GP 1MHZ RRO SOT23-5; Number of Circuits: 1; Slew Rate: 0.6 V/µs; Current - Supply: 100µA; Current - Output / Channel: 23mA; Voltage - Supply, Single/Dual (±): 1.8 V ~ 6 V; Supplier 1: Digi-Key; Supplier Part Number 1: MCP6001T-I/OTCT-ND; RoHS: RoHS Compliant; Category: Integrated Circuits (ICs); Stock 1: 80833; Pricing 1: 1=0.39, 25=0.3224, 100=0.2902 (CAD); Packaging: Cut Tape (CT); Part Status: Active; Amplifier Type: General Purpose; Output Type: Rail-to-Rail; -3db Bandwidth: -; Operating Temperature: -40°C ~ 85°C; Mounting Type: Surface Mount; Package / Case: SC-74A, SOT-753; Supplier Device Package: SOT-23-5; ComponentLink1URL: http://www.microchip.com/mymicrochip/filehandler.aspx?ddocname=en011705; ComponentLink1Description: http://www.microchip.com/mymicrochip/filehandler.aspx?ddocname=en011705
U3 = IC CURRENT AMPLIFIER SC70-6: Current Sense Amplifier 1 Circuit SC-70-6; Manufacturer 1: Texas Instruments; Description 1: IC OPAMP CURR SENSE 80KHZ SC70-6; Number of Circuits: 1; Slew Rate: 0.4 V/µs; Current - Supply: 65µA; Voltage - Supply, Single/Dual (±): 2.7 V ~ 26 V; Supplier 1: Digi-Key; Supplier Part Number 1: 296-40118-1-ND; RoHS: RoHS Compliant; Category: Integrated Circuits (ICs); Stock 1: 6627; Pricing 1: 1=1.36, 10=1.197, 100=0.9177, 500=0.7255, 1000=0.58041 (CAD); Packaging: Cut Tape (CT); Part Status: Active; Amplifier Type: Current Sense; Output Type: -; -3db Bandwidth: -; Current - Output / Channel: -; Operating Temperature: -40°C ~ 125°C; Mounting Type: Surface Mount; Package / Case: 6-TSSOP, SC-88, SOT-363; Supplier Device Package: SC-70-6; ComponentLink1URL: http://www.ti.com/lit/ds/symlink/ina199.pdf; ComponentLink1Description: http://www.ti.com/lit/ds/symlink/ina199.pdf